# Altium schematic sheet LPCB235 - IMU.SchDoc
size A3; Address1: Unit 4; DocumentNumber: 14; Revision: 2; SheetNumber: 14; SheetTotal: 37; Lockie__PCB_SUB_ASSEMBLY: Inertial Measurement Unit; Lockie__PCB_ASSEMBLY: FCU PCB; Lockie__LDL: LPCB235; Lockie__PCB_DESCRIPTION: Flight Control Unit
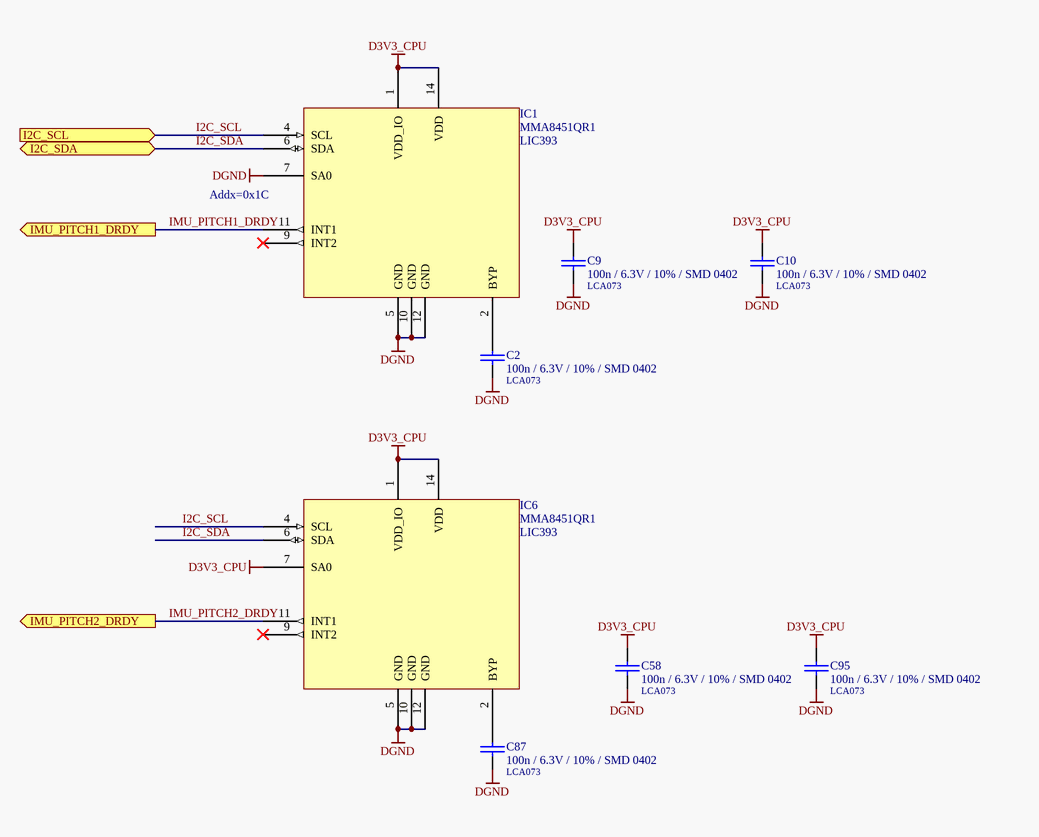
[diagram p0: LPCB235 - IMU.SchDoc]

## Parts
C2  100n / 6.3V / 10% / SMD 0402  LDL_NUMBER: LCA073  [LFP012__CC1005-0402-IPC7351_B]
C9  100n / 6.3V / 10% / SMD 0402  LDL_NUMBER: LCA073  [LFP012__CC1005-0402-IPC7351_B]
C10  100n / 6.3V / 10% / SMD 0402  LDL_NUMBER: LCA073  [LFP012__CC1005-0402-IPC7351_B]
C58  100n / 6.3V / 10% / SMD 0402  LDL_NUMBER: LCA073  [LFP012__CC1005-0402-IPC7351_B]
C87  100n / 6.3V / 10% / SMD 0402  LDL_NUMBER: LCA073  [LFP012__CC1005-0402-IPC7351_B]
C95  100n / 6.3V / 10% / SMD 0402  LDL_NUMBER: LCA073  [LFP012__CC1005-0402-IPC7351_B]
IC1  MMA8451QR1  LDL_NUMBER: LIC393  [LFP051__QFN16]
IC6  MMA8451QR1  LDL_NUMBER: LIC393  [LFP051__QFN16]

## Ports
I2C_SCL (in), I2C_SDA (bidir), IMU_PITCH1_DRDY (out), IMU_PITCH2_DRDY (out)

## Nets
D3V3_CPU: C9.1 C10.1 C58.1 C95.1 IC1.1(VDD_IO) IC1.14(VDD) IC6.1(VDD_IO) IC6.7(SA0) IC6.14(VDD)
DGND: C2.2 C9.2 C10.2 C58.2 C87.2 C95.2 IC1.5(GND) IC1.7(SA0) IC1.10(GND) IC1.12(GND) IC6.5(GND) IC6.10(GND) IC6.12(GND)
I2C_SCL: IC1.4(SCL) IC6.4(SCL) ; port I2C_SCL
I2C_SDA: IC1.6(SDA) IC6.6(SDA) ; port I2C_SDA
IMU_PITCH1_DRDY: IC1.11(INT1) ; port IMU_PITCH1_DRDY
IMU_PITCH2_DRDY: IC6.11(INT1) ; port IMU_PITCH2_DRDY
NetC2_1: C2.1 IC1.2(BYP)
NetC87_1: C87.1 IC6.2(BYP)

Not connected (* = marked no-connect by the designer): IC1 9(INT2)*; IC6 9(INT2)*

## Notes on the sheet
- (near IC1) Addx=0x1C
- PCB COMPONENT DESCRIPTION
- LDL NUMBER
- Assembly Details
- Size
- Drawing File Name
- Revision
- http://rloop.org
- Scale
- A3
- Sheet Details
- N.T.S
- Sheet:
- Of:

## Library data of the parts
C2 = 100n / 6.3V / 10% / SMD 0402: Capacitor, Ceramic Chip, 100nF (0.1uF), 6.3V, 10%, SMD 0402 [LCA073]; FMEDA__FUNCTION_IN_SYSTEM: PITCH ACCEL 1 FILTER; FMEDA__OPERATING__TEMP_MAX: 50; FMEDA__OPERATING__TEMP_TYP: 27; FMEDA__OPERATING__TEMP_MIN: -20; FMEDA__OPERATING__VOLTAGE_MAX: 3.3; FMEDA__OPERATING__VOLTAGE_MIN: 0; FMEDA__CHANNEL: COM; Value: 100n; FMEDA__OPERATING__VOLTAGE_TYP: 3.3
C9 C10 C58 C95 = 100n / 6.3V / 10% / SMD 0402: Capacitor, Ceramic Chip, 100nF (0.1uF), 6.3V, 10%, SMD 0402 [LCA073]; FMEDA__FUNCTION_IN_SYSTEM: ACCEL BYPASS; FMEDA__OPERATING__TEMP_MAX: 50; FMEDA__OPERATING__TEMP_TYP: 27; FMEDA__OPERATING__TEMP_MIN: -20; FMEDA__OPERATING__VOLTAGE_MAX: 3.3; FMEDA__OPERATING__VOLTAGE_MIN: 0; FMEDA__CHANNEL: COM; Value: 100n; FMEDA__OPERATING__VOLTAGE_TYP: 3.3
C87 = 100n / 6.3V / 10% / SMD 0402: Capacitor, Ceramic Chip, 100nF (0.1uF), 6.3V, 10%, SMD 0402 [LCA073]; FMEDA__FUNCTION_IN_SYSTEM: PITCH ACCEL 2 FILTER; FMEDA__OPERATING__TEMP_MAX: 50; FMEDA__OPERATING__TEMP_TYP: 27; FMEDA__OPERATING__TEMP_MIN: -20; FMEDA__OPERATING__VOLTAGE_MAX: 3.3; FMEDA__OPERATING__VOLTAGE_MIN: 0; FMEDA__CHANNEL: COM; Value: 100n; FMEDA__OPERATING__VOLTAGE_TYP: 3.3
IC1 IC6 = MMA8451QR1: IC, Accelerometer, 3-Axis, 3.3V, I2C, SMD QFN16 [LIC393]; FMEDA__OPERATING__TEMP_MAX: 50; FMEDA__OPERATING__TEMP_MIN: -20; FMEDA__OPERATING__TEMP_TYP: 27; FMEDA__OPERATING__VOLTAGE_MAX: 3.3; FMEDA__OPERATING__VOLTAGE_MIN: 0; FMEDA__CHANNEL: COM; FMEDA__OPERATING__VOLTAGE_TYP: 3.3; FMEDA__FUNCTION_IN_SYSTEM: *